# Altium project Ultrasonic Module_V1.1.PrjPcb
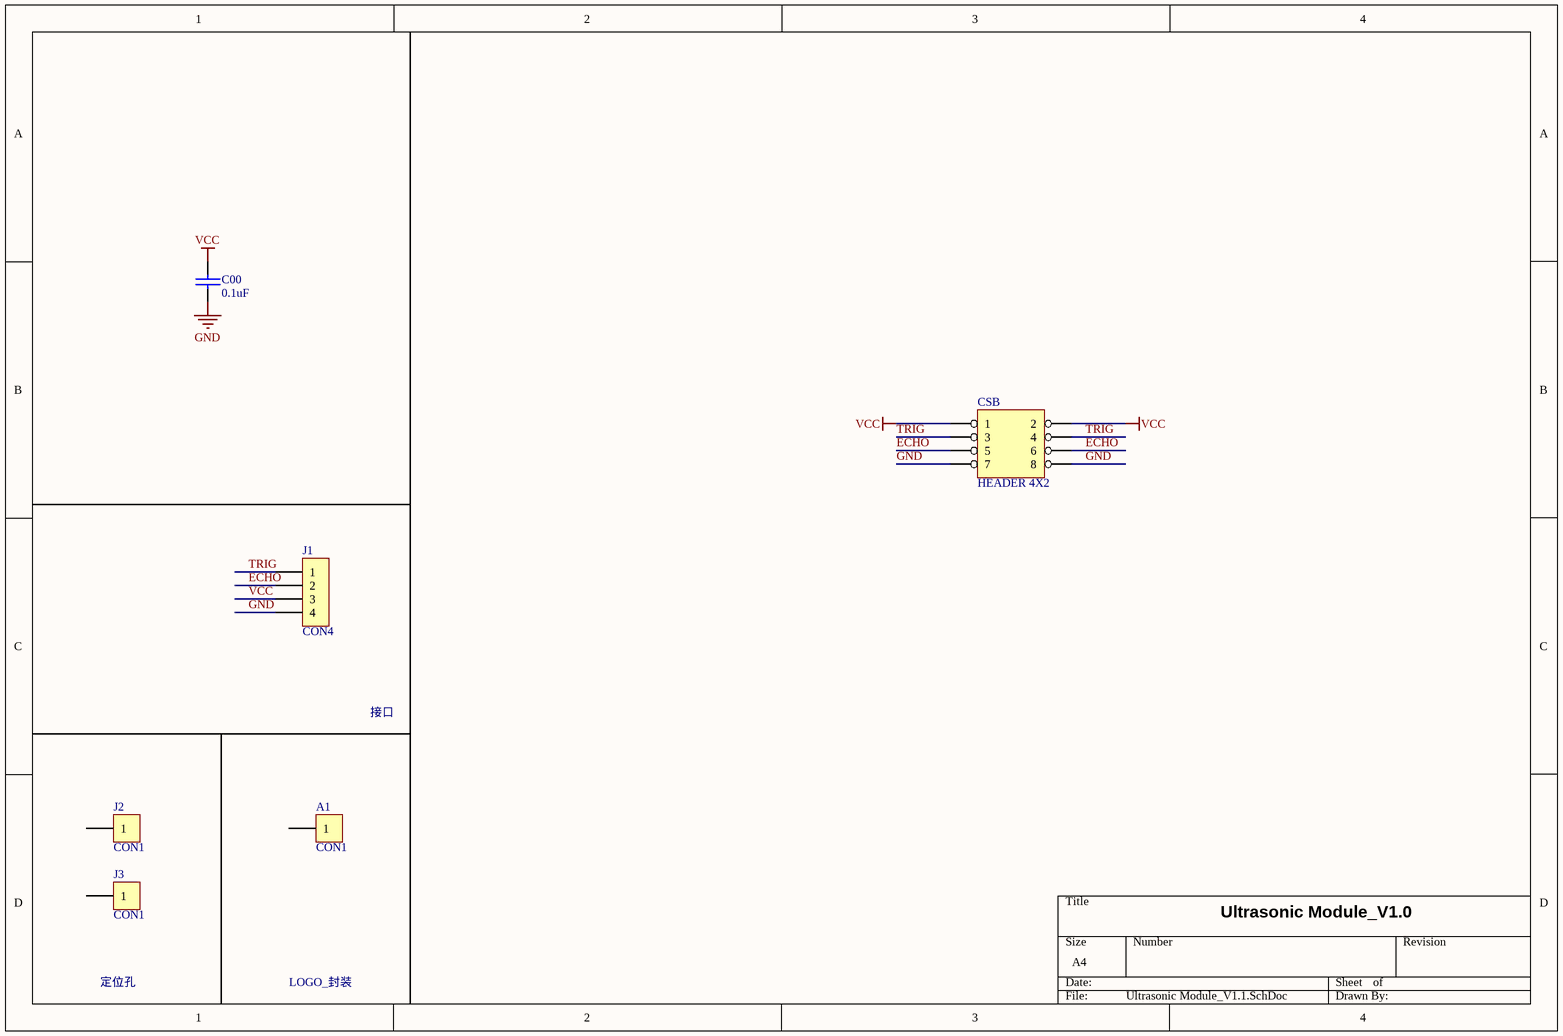
[diagram p0: Ultrasonic Module_V1.1.SchDoc]
1 sheet, 6 parts. Net scope: global (net labels, ports and power ports of the same name join across sheets).
Board file: Ultrasonic Module_Poly_V1.1.PcbDoc

## Sheet Ultrasonic Module_V1.1.SchDoc
size A4

### Parts
A1  CON1  [GD32LOGO]
C00  0.1uF  [0805C]
CSB  HEADER 4X2  [IDC8-JLC]
J1  CON4  [SIP4]
J2  CON1  [HOLE-4.8]
J3  CON1  [HOLE-4.8]

### Nets
GND: C00.2 CSB.7 CSB.8 J1.4
VCC: C00.1 CSB.1 CSB.2 J1.3
ECHO: CSB.5 CSB.6 J1.2
TRIG: CSB.3 CSB.4 J1.1

Not connected (* = marked no-connect by the designer): A1 1; J2 1; J3 1

### Notes on the sheet
- 接口
- Ultrasonic Module_V1.0
- 定位孔
- LOGO_封装

### Library data of the parts
A1 J2 J3 = CON1: Connector
C00 = CAP: Capacitor
J1 = CON4: Connector